# Altium project u1_heater_control.PrjPcb
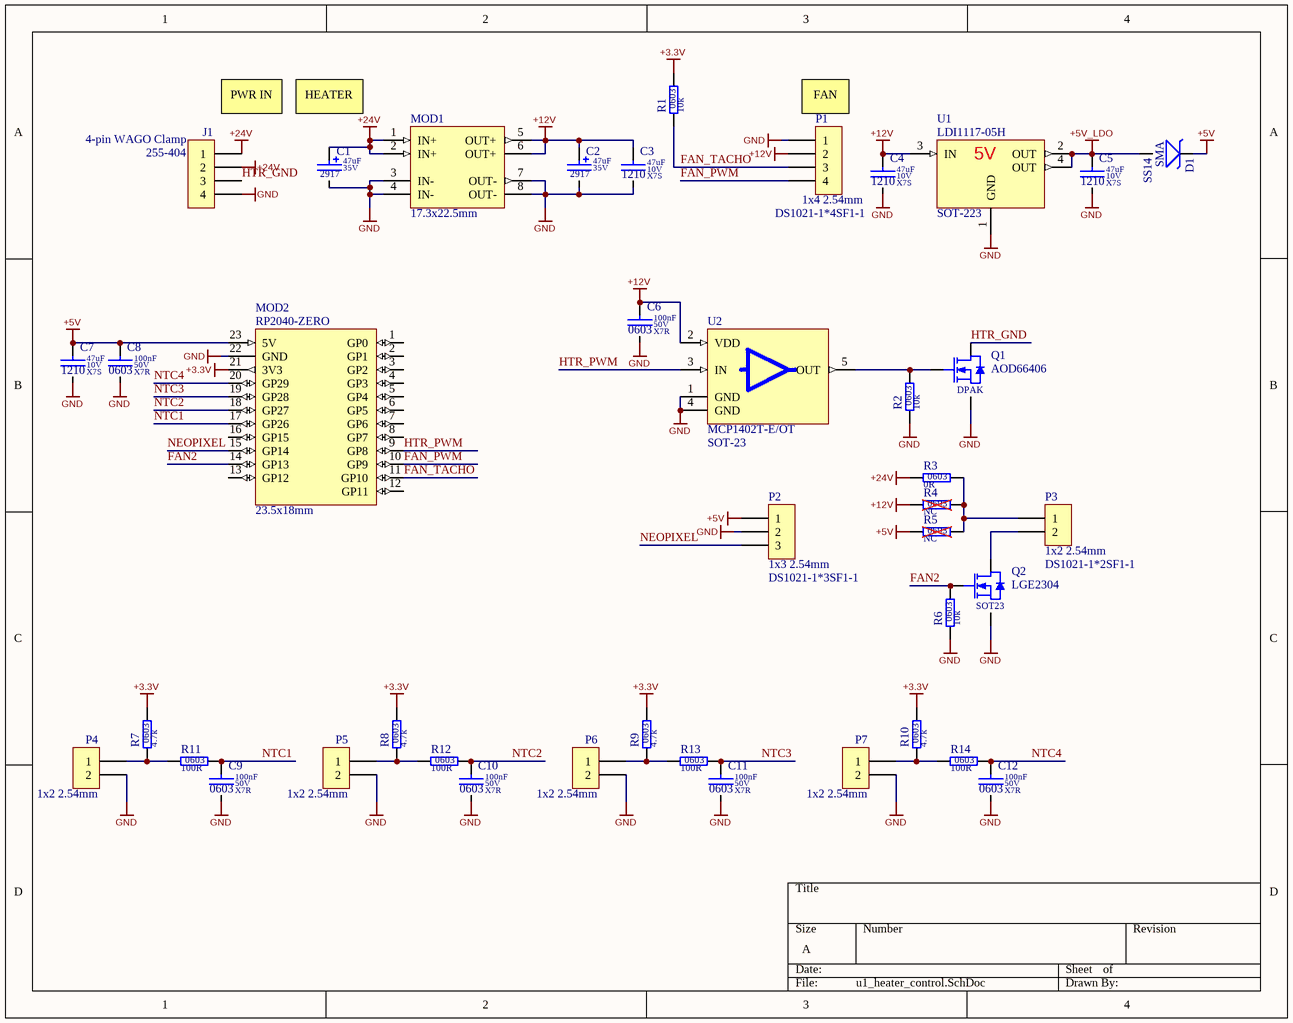
[diagram p0: u1_heater_control.SchDoc]
1 sheet, 41 parts. Net scope: global (net labels, ports and power ports of the same name join across sheets).
Board file: u1_heater_control.PcbDoc

## Sheet u1_heater_control.SchDoc
size A; SheetNumber: 1; SheetTotal: 1

### Parts
C1  value 47uF  SCH_Footprint: 2917  Voltage: 35V  [CT_2917_7343]  (hidden comment: Tantalum Capacitor)
C2  value 47uF  SCH_Footprint: 2917  Voltage: 35V  [CT_2917_7343]  (hidden comment: Tantalum Capacitor)
C3  value 47uF  Dielectric: X7S  Voltage: 10V  SCH_Footprint: 1210  [C_1210_3225]  (hidden comment: Ceramic X7S)
C4  value 47uF  Dielectric: X7S  Voltage: 10V  SCH_Footprint: 1210  [C_1210_3225]  (hidden comment: Ceramic X7S)
C5  value 47uF  Dielectric: X7S  Voltage: 10V  SCH_Footprint: 1210  [C_1210_3225]  (hidden comment: Ceramic X7S)
C6  value 100nF  Dielectric: X7R  Voltage: 50V  SCH_Footprint: 0603  [C_0603_1608]  (hidden comment: Ceramic X7R)
C7  value 47uF  Dielectric: X7S  Voltage: 10V  SCH_Footprint: 1210  [C_1210_3225]  (hidden comment: Ceramic X7S)
C8  value 100nF  Dielectric: X7R  Voltage: 50V  SCH_Footprint: 0603  [C_0603_1608]  (hidden comment: Ceramic X7R)
C9  value 100nF  Dielectric: X7R  Voltage: 50V  SCH_Footprint: 0603  [C_0603_1608]  (hidden comment: Ceramic X7R)
C10  value 100nF  Dielectric: X7R  Voltage: 50V  SCH_Footprint: 0603  [C_0603_1608]  (hidden comment: Ceramic X7R)
C11  value 100nF  Dielectric: X7R  Voltage: 50V  SCH_Footprint: 0603  [C_0603_1608]  (hidden comment: Ceramic X7R)
C12  value 100nF  Dielectric: X7R  Voltage: 50V  SCH_Footprint: 0603  [C_0603_1608]  (hidden comment: Ceramic X7R)
D1  SCH_Footprint: SMA  [SMA_DO-214AC]  (hidden comment: SS14)
J1  value 255-404  SCH_Footprint: 4-pin WAGO Clamp  [J_255-404]  (hidden comment: Wago Clamping terminal strip)
MOD1  SCH_Footprint: 17.3x22.5mm  [MOD_BUCK_MP1584]  (hidden comment: Low cost, Aliexpress-ready DC-DC buck converter using MP1584)
MOD2  value RP2040-ZERO  SCH_Footprint: 23.5x18mm  [MOD_RP2040-ZERO]  (hidden comment: RP2040 module)
P1  value DS1021-1*4SF1-1  SCH_Footprint: 1x4 2.54mm  [P_HEADER_1x4_2.54]  (hidden comment: Goldpin)
P2  value DS1021-1*3SF1-1  SCH_Footprint: 1x3 2.54mm  [P_HEADER_1x3_2.54]  (hidden comment: Goldpin)
P3  value DS1021-1*2SF1-1  SCH_Footprint: 1x2 2.54mm  [P_HEADER_1x2_2.54]  (hidden comment: Goldpin)
P4  SCH_Footprint: 1x2 2.54mm  [P_HEADER_1x2_2.54]  (hidden comment: Goldpin)
P5  SCH_Footprint: 1x2 2.54mm  [P_HEADER_1x2_2.54]  (hidden comment: Goldpin)
P6  SCH_Footprint: 1x2 2.54mm  [P_HEADER_1x2_2.54]  (hidden comment: Goldpin)
P7  SCH_Footprint: 1x2 2.54mm  [P_HEADER_1x2_2.54]  (hidden comment: Goldpin)
Q1  SCH_Footprint: DPAK  [DPAK_TO252-3_SC63_M]  (hidden comment: AOD66406)
Q2  SCH_Footprint: SOT23  [SOT23_TO236_SC59]  (hidden comment: LGE2304)
R1  value 10k  SCH_Footprint: 0603  [R_0603_1608]  (hidden comment: Resistor)
R2  value 10k  SCH_Footprint: 0603  [R_0603_1608]  (hidden comment: Resistor)
R3  value 0R  SCH_Footprint: 0603  [R_0603_1608]  (hidden comment: Resistor)
R4  value NC  SCH_Footprint: 0603  [R_NC_0603_1608]  (hidden comment: Resistor)  (no BOM)
R5  value NC  SCH_Footprint: 0603  [R_NC_0603_1608]  (hidden comment: Resistor)  (no BOM)
R6  value 10k  SCH_Footprint: 0603  [R_0603_1608]  (hidden comment: Resistor)
R7  value 4.7k  SCH_Footprint: 0603  [R_0603_1608]  (hidden comment: Resistor)
R8  value 4.7k  SCH_Footprint: 0603  [R_0603_1608]  (hidden comment: Resistor)
R9  value 4.7k  SCH_Footprint: 0603  [R_0603_1608]  (hidden comment: Resistor)
R10  value 4.7k  SCH_Footprint: 0603  [R_0603_1608]  (hidden comment: Resistor)
R11  value 100R  SCH_Footprint: 0603  [R_0603_1608]  (hidden comment: Resistor)
R12  value 100R  SCH_Footprint: 0603  [R_0603_1608]  (hidden comment: Resistor)
R13  value 100R  SCH_Footprint: 0603  [R_0603_1608]  (hidden comment: Resistor)
R14  value 100R  SCH_Footprint: 0603  [R_0603_1608]  (hidden comment: Resistor)
U1  value LDI1117-05H  SCH_Footprint: SOT-223  [SOT223_SC73]  (hidden comment: 1-A, 20-V, linear voltage regulator 4-SOT-223)
U2  value MCP1402T-E/OT  SCH_Footprint: SOT-23  [SOT23-5_SC74A_SOT753_M]  (hidden comment: Mosfet driver)

### Nets
+3.3V: MOD2.21(3V3) R1.2 R7.2 R8.2 R9.2 R10.2
+5V: C7.1 C8.1 D1.1 MOD2.23(5V) P2.1 R5.1
+5V_LDO: C5.1 D1.2 U1.2(OUT) U1.4(OUT)
+12V: C2.1 C3.1 C4.1 C6.1 MOD1.5(OUT+) MOD1.6(OUT+) P1.2 R4.1 U1.3(IN) U2.2(VDD)
+24V: C1.1 J1.1 J1.2 MOD1.1(IN+) MOD1.2(IN+) R3.1
GND: C1.2 C2.2 C3.2 C4.2 C5.2 C6.2 C7.2 C8.2 C9.2 C10.2 C11.2 C12.2 J1.4 MOD1.3(IN-) MOD1.4(IN-) MOD1.7(OUT-) MOD1.8(OUT-) MOD2.22(GND) P1.1 P2.2 P4.2 P5.2 P6.2 P7.2 Q1.3(S) Q2.2(S) R2.1 R6.1 U1.1(GND) U2.1(GND) U2.4(GND)
FAN2: MOD2.14(GP13) Q2.1(G) R6.2
FAN_PWM: MOD2.10(GP9) P1.4
FAN_TACHO: MOD2.11(GP10) P1.3 R1.1
HTR_GND: J1.3 Q1.2(D)
HTR_PWM: MOD2.9(GP8) U2.3(IN)
NEOPIXEL: MOD2.15(GP14) P2.3
NTC1: C9.1 MOD2.17(GP26) R11.2
NTC2: C10.1 MOD2.18(GP27) R12.2
NTC3: C11.1 MOD2.19(GP28) R13.2
NTC4: C12.1 MOD2.20(GP29) R14.2
NetP3_1: P3.1 R3.2 R4.2 R5.2
NetP3_2: P3.2 Q2.3(D)
NetP4_1: P4.1 R7.1 R11.1
NetP5_1: P5.1 R8.1 R12.1
NetP6_1: P6.1 R9.1 R13.1
NetP7_1: P7.1 R10.1 R14.1
NetQ1_1: Q1.1(G) R2.2 U2.5(OUT)

Not connected (* = marked no-connect by the designer): MOD2 1(GP0) 2(GP1) 3(GP2) 4(GP3) 5(GP4) 6(GP5) 7(GP6) 8(GP7) 12(GP11) 13(GP12) 16(GP15)

### Notes on the sheet
- (near J1) PWR IN
- HEATER
- (near P1) FAN

### Library data of the parts
C1 C2 = CT_47uF_35V_TA2O5_2917_20_T541: Capacitor; Manufacturer: Kemet; Manufacturer Part Number: T541X476M035AH6710; Dielectric: TA2O5; Tolerance (%): 20; Part Number: CT_47uF_35V_TA2O5_2917_20_T541; HelpURL: https://content.kemet.com/datasheets/KEM_T2077_T540-541.pdf; Supplier 1: TME; Supplier 2: RS Components; Supplier 3: Farnell; Supplier Part Number 3: 2885835; Supplier 4: Mouser; Supplier Part Number 4: 80-T541X476M35AH6710; Supplier 5: Digi-Key; Supplier Part Number 5: 399-T541X476M035AH6710CT-ND; Supplier 6: LCSC; Supplier 7: Avnet; Supplier Part Number 7: T541X476M035AH6710
C3-C5 C7 = C_47uF_10V_X7S_1210_10_AECQ1: Capacitor; Manufacturer: Murata; Manufacturer Part Number: GCM32EC71A476KE02; Tolerance (%): 10; AEC-Q: 1; Part Number: C_47uF_10V_X7S_1210_10_AECQ1; HelpURL: https://www.murata.com/products/productdetail?partno=GCM32EC71A476KE02%23; Supplier 1: TME; Supplier Part Number 1: GCM32EC71A476KE02L; Supplier 2: RS Components; Supplier 3: Farnell; Supplier Part Number 3: 4128612; Supplier 4: Mouser; Supplier Part Number 4: 81-GCM32EC71A476KE2L; Supplier 5: Digi-Key; Supplier Part Number 5: 490-GCM32EC71A476KE02LCT-ND; Supplier 6: LCSC; Supplier Part Number 6: C3019535
C6 C8-C12 = C_100nF_50V_X7R_0603_5: Capacitor; Manufacturer: Samsung; Manufacturer Part Number: CL10B104JB8NNNC; Tolerance (%): 5; Part Number: C_100nF_50V_X7R_0603_5; HelpURL: http://www.tme.eu/pl/Document/4a42202b32dab16128fe107dd69598cc/samsung-chip-cap.pdf; Supplier 1: TME; Supplier Part Number 1: CL10B104JB8NNNC; Supplier 2: RS Components; Supplier Part Number 2: 7665455; Supplier 3: Farnell; Supplier 4: Mouser; Supplier 5: Digi-Key; Supplier Part Number 5: 1276-1033-1-ND; Supplier 6: LCSC; Supplier Part Number 6: C24452
D1 = DS_SS14_1A_40V_SMA: Manufacturer: ON Semiconductor; Voltage: 40V; Current: 1A; Value: SS14; Part Number: DS_SS14_1A_40V_SMA; HelpURL: https://www.vishay.com/docs/88746/ss12.pdf; Manufacturer Part Number: SS14; Supplier 1: TME; Supplier Part Number 1: SS14-FAI; Supplier 2: RS Components; Supplier Part Number 2: 7390467P; Supplier 3: Farnell; Supplier Part Number 3: 1467537; Supplier 4: Mouser; Supplier Part Number 4: 512-SS14; Supplier 5: Digi-Key; Supplier Part Number 5: SS14CT-ND; Supplier 6: LCSC
J1 = J_255-404: Pin Header; Part Number: J_255-404; HelpURL: https://www.tme.eu/Document/96bfd47690e21918702c38ee5593d4a8/255-404.pdf; Manufacturer: Wago; Manufacturer Part Number: 255-404; Supplier 1: TME; Supplier Part Number 1: 255-404; Supplier 2: RS Components; Supplier 3: Farnell; Supplier 4: Mouser; Supplier 5: Digi-Key; Supplier 6: LCSC
MOD1 = MOD_BUCK_MP1584: Value: -; Part Number: MOD_BUCK_MP1584; HelpURL: https://pl.aliexpress.com/item/32341006065.html; Manufacturer: -; Manufacturer Part Number: -; Supplier 1: TME; Supplier 2: RS Components; Supplier 3: Farnell; Supplier 4: Mouser; Supplier 5: Digi-Key; Supplier 6: LCSC; Supplier 7: -; Supplier Part Number 7: -
MOD2 = MOD_RP2040-ZERO: Manufacturer: Waveshare; Part Number: MOD_RP2040-ZERO; HelpURL: https://www.waveshare.com/wiki/RP2040-Zero; Manufacturer Part Number: RP2040-ZERO; Supplier 1: TME; Supplier 2: RS Components; Supplier 3: Farnell; Supplier 4: Mouser; Supplier 5: Digi-Key; Supplier 6: LCSC; Supplier 7: Botland; Supplier Part Number 7: WSR-20536
P1 = P_HEADER_1x4_2.54: Pin Header; Manufacturer: Connfly; Part Number: P_HEADER_1x4_2.54; HelpURL: http://datasheet.octopart.com/DS1021-1%2A4SF1-1-Connfly-datasheet-65537859.pdf; Manufacturer Part Number: DS1021-1*4SF1-1; Supplier 1: TME; Supplier Part Number 1: ZL201-04G; Supplier 2: RS Components; Supplier 3: Farnell; Supplier 4: Mouser; Supplier 5: Digi-Key; Supplier 6: LCSC
P2 = P_HEADER_1x3_2.54: Pin Header; Manufacturer: Connfly; Part Number: P_HEADER_1x3_2.54; HelpURL: http://www.tme.eu/en/Document/cc301e58a5da78cb543a94b5a5b7f06a/DS1021.pdf; Manufacturer Part Number: DS1021-1*3SF1-1; Supplier 1: TME; Supplier Part Number 1: ZL201-03G; Supplier 2: RS Components; Supplier 3: Farnell; Supplier 4: Mouser; Supplier 5: Digi-Key; Supplier 6: LCSC
P3 = P_HEADER_1x2_2.54: Pin Header; Manufacturer: Connfly; Part Number: P_HEADER_1x2_2.54; HelpURL: http://www.tme.eu/en/Document/cc301e58a5da78cb543a94b5a5b7f06a/DS1021.pdf; Manufacturer Part Number: DS1021-1*2SF1-1; Supplier 1: TME; Supplier Part Number 1: ZL201-02G; Supplier 2: RS Components; Supplier 3: Farnell; Supplier 4: Mouser; Supplier 5: Digi-Key; Supplier 6: LCSC
P4-P7 = P_HEADER_1x2_2.54: Pin Header; Manufacturer: Connfly; Value: DS1021-1*2SF1-1; Part Number: P_HEADER_1x2_2.54; HelpURL: http://www.tme.eu/en/Document/cc301e58a5da78cb543a94b5a5b7f06a/DS1021.pdf; Manufacturer Part Number: DS1021-1*2SF1-1; Supplier 1: TME; Supplier Part Number 1: ZL201-02G; Supplier 2: RS Components; Supplier 3: Farnell; Supplier 4: Mouser; Supplier 5: Digi-Key; Supplier 6: LCSC
Q1 = QN_AOD66406: Manufacturer: Alpha&Omega Semiconductor; Type: N-MOS; Voltage: 40V; Current: 60A; Value: AOD66406; Part Number: QN_AOD66406; HelpURL: https://www.aosmd.com/sites/default/files/res/datasheets/AOD66406.pdf; Manufacturer Part Number: AOD66406; Supplier 1: TME; Supplier Part Number 1: AOD66406; Supplier 2: RS Components; Supplier 3: Farnell; Supplier 4: Mouser; Supplier 5: Digi-Key; Supplier Part Number 5: 785-AOD66406CT-ND; Supplier 6: LCSC
Q2 = QN_LGE2304: Manufacturer: Luguang Electronic Technology; Type: N-MOS; Voltage: 30V; Current: 3.3A; Value: LGE2304; Part Number: QN_LGE2304; HelpURL: https://www.tme.eu/Document/1846c69c61200204c6c8d6a9d434d9dd/LGE2304.pdf; Manufacturer Part Number: LGE2304; Supplier 1: TME; Supplier Part Number 1: LGE2304-LGE; Supplier 2: RS Components; Supplier 3: Farnell; Supplier 4: Mouser; Supplier 5: Digi-Key; Supplier 6: LCSC
R1 R2 R6 = R_10k_0603_1_AECQ0: Manufacturer: Panasonic; Manufacturer Part Number: ERJ-3EKF1002V; Voltage: 75V; Power: 100mW; Tolerance: 1%; AEC-Q: 0; Part Number: R_10k_0603_1_AECQ0; HelpURL: https://industrial.panasonic.com/cdbs/www-data/pdf/RDA0000/AOA0000C304.pdf; Supplier 1: TME; Supplier Part Number 1: ERJ3EKF1002V; Supplier 2: RS Components; Supplier 3: Farnell; Supplier Part Number 3: 2303192; Supplier 4: Mouser; Supplier Part Number 4: 667-ERJ-3EKF1002V; Supplier 5: Digi-Key; Supplier Part Number 5: P10.0KHCT-ND; Supplier 6: LCSC; Supplier Part Number 6: C191124
R3 = R_0R_0603_1: Manufacturer: Yageo; Manufacturer Part Number: RC0603FR-070RL; Voltage: 75V; Power: 100mW; Tolerance: 1%; Part Number: R_0R_0603_1; HelpURL: https://datasheet.octopart.com/RC0603FR-070RL-Yageo-datasheet-8328172.pdf; Supplier 1: TME; Supplier Part Number 1: RC0603FR-070RL; Supplier 2: RS Components; Supplier 3: Farnell; Supplier Part Number 3: 2309106; Supplier 4: Mouser; Supplier Part Number 4: 603-RC0603FR-070RL; Supplier 5: Digi-Key; Supplier Part Number 5: 311-0.0HRCT-ND; Supplier 6: LCSC; Supplier Part Number 6: C100044
R4 R5 = R_GENERIC_0603: Part Number: R_GENERIC_0603; HelpURL: -; Manufacturer: -; Manufacturer Part Number: -; Supplier 1: TME; Supplier 2: RS Components; Supplier 3: Farnell; Supplier 4: Mouser; Supplier 5: Digi-Key; Supplier 6: LCSC
R7-R10 = R_4.7k_0603_1: Manufacturer: Yageo; Manufacturer Part Number: RC0603FR-074K7L; Voltage: 75V; Power: 100mW; Tolerance: 1%; Part Number: R_4.7k_0603_1; HelpURL: http://www.farnell.com/datasheets/2167052.pdf?_ga=2.156163131.1690599162.1548417389-1379097396.1542296996&_gac=1.18389067.1547230258.Cj0KCQiAmuHhBRD0ARIsAFWyPwhX8HcvXnM3tA0ZBodZLzDIjH2ZxLpjT5LWo9bad_HPRbU8LfPq44UaAhEwEALw_wcB; Supplier 1: TME; Supplier Part Number 1: RC0603FR-074K7; Supplier 2: RS Components; Supplier 3: Farnell; Supplier Part Number 3: 9238565; Supplier 4: Mouser; Supplier Part Number 4: 603-RC0603FR-074K7L; Supplier 5: Digi-Key; Supplier Part Number 5: 311-4.70KHRCT-ND; Supplier 6: LCSC
R11-R14 = R_100R_0603_1: Manufacturer: Yageo; Manufacturer Part Number: RC0603FR-07100RL; Voltage: 50V; Power: 100mW; Tolerance: 1%; Part Number: R_100R_0603_1; HelpURL: http://www.tme.eu/en/Document/d2a72e545e5c8eb7bf2a04fa97535928/rc0603yageo.pdf; Supplier 1: TME; Supplier Part Number 1: RC0603FR-07100R; Supplier 2: RS Components; Supplier 3: Farnell; Supplier Part Number 3: 2131804; Supplier 4: Mouser; Supplier Part Number 4: 603-RC0603FR-07100RL; Supplier 5: Digi-Key; Supplier Part Number 5: 311-100HRCT-ND; Supplier 6: LCSC
U1 = VL_LDI1117-05H: typical configuration; Manufacturer: Diotec; Voltage: 5V; Current: 1A; Part Number: VL_LDI1117-05H; HelpURL: https://www.tme.eu/Document/084a5eb18462203f10c4803bc35208f3/ldi1117h.pdf; Manufacturer Part Number: LDI1117-05H; Supplier 1: TME; Supplier Part Number 1: LDI1117-05H-DIO; Supplier 2: RS Components; Supplier 3: Farnell; Supplier Part Number 3: 4553249; Supplier 4: Mouser; Supplier Part Number 4: 637-LDI1117-05H; Supplier 5: Digi-Key; Supplier Part Number 5: 4878-LDI1117-05HCT-ND; Supplier 6: LCSC
U2 = U_MCP1402T-E/OT: Manufacturer: Microchip; Part Number: U_MCP1402T-E/OT; HelpURL: http://ww1.microchip.com/downloads/en/DeviceDoc/20002052D.pdf; Manufacturer Part Number: MCP1402T-E/OT; Supplier 1: TME; Supplier Part Number 1: MCP1402T-E/OT; Supplier 2: RS Components; Supplier Part Number 2: 6684203; Supplier 3: Farnell; Supplier Part Number 3: 1439711; Supplier 4: Mouser; Supplier Part Number 4: 579-MCP1402T-E/OT; Supplier 5: Digi-Key; Supplier Part Number 5: MCP1402T-E/OTCT-ND; Supplier 6: LCSC

## Assembly variants
now: not fitted MOD1